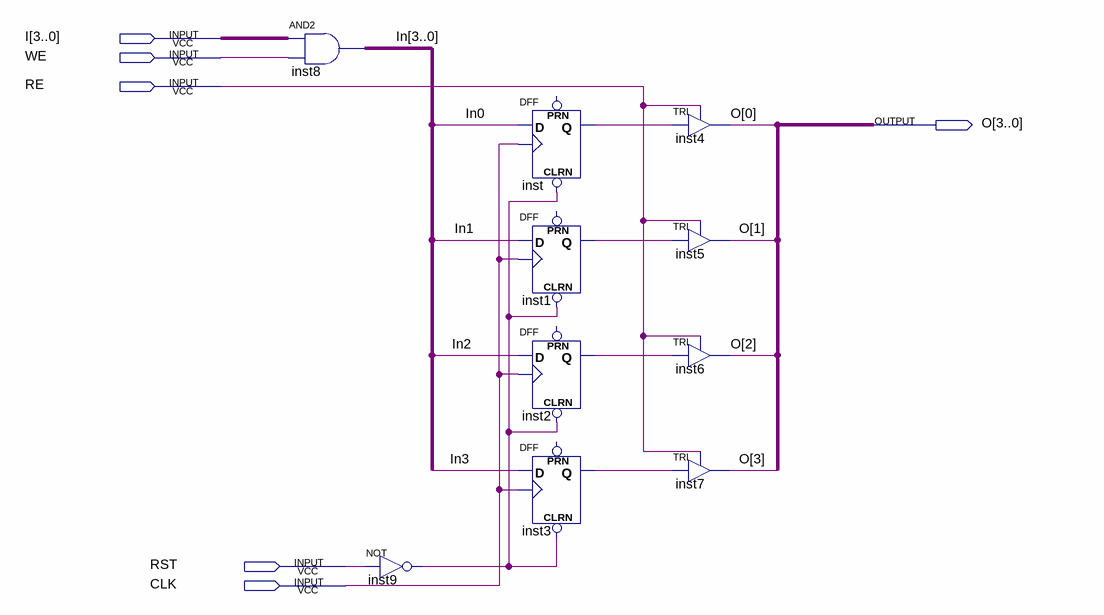
[diagram p0: schematic sheet]
// Quartus schematic Register4.bdf as structural Verilog: 10 symbols, 6 pins
module Register4 (
  input  [3:0] I,
  input  WE,
  input  RE,
  input  RST,
  input  CLK,
  output [3:0] O
);

  wire inst1_q, inst2_q, inst3_q, inst9_out, inst_q;
  wire [3:0] In;

  assign In = I & {4{WE}};  // AND2 inst8, 4 bits wide
  not inst9 (inst9_out, RST);
  DFF inst (.CLRN(inst9_out), .CLK(CLK), .D(In[0]), .Q(inst_q));  // open: PRN
  DFF inst1 (.CLRN(inst9_out), .CLK(CLK), .D(In[1]), .Q(inst1_q));  // open: PRN
  DFF inst2 (.CLRN(inst9_out), .CLK(CLK), .D(In[2]), .Q(inst2_q));  // open: PRN
  DFF inst3 (.CLRN(inst9_out), .CLK(CLK), .D(In[3]), .Q(inst3_q));  // open: PRN
  TRI inst4 (.IN(inst_q), .OE(RE), .OUT(O[0]));
  TRI inst5 (.IN(inst1_q), .OE(RE), .OUT(O[1]));
  TRI inst6 (.IN(inst2_q), .OE(RE), .OUT(O[2]));
  TRI inst7 (.IN(inst3_q), .OE(RE), .OUT(O[3]));
endmodule
